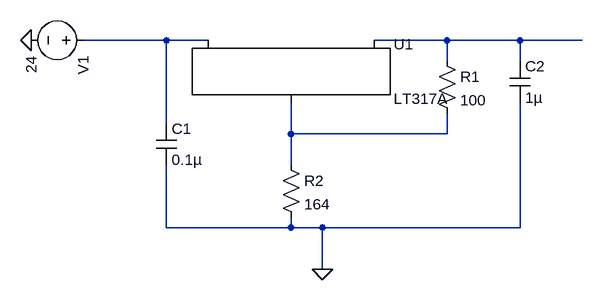
[diagram p0: schematic Draft1.asc]
Draft1.asc, the LTspice schematic file:
Version 4
SHEET 1 1972 680
WIRE -496 -96 -624 -96
WIRE -432 -96 -496 -96
WIRE -64 -96 -176 -96
WIRE 48 -96 -64 -96
WIRE 144 -96 48 -96
WIRE -64 -64 -64 -96
WIRE 48 -64 48 -96
WIRE -496 32 -496 -96
WIRE -304 48 -304 0
WIRE -64 48 -64 16
WIRE -64 48 -304 48
WIRE -304 96 -304 48
WIRE -496 192 -496 96
WIRE -304 192 -304 176
WIRE -304 192 -496 192
WIRE -256 192 -304 192
WIRE 48 192 48 0
WIRE 48 192 -256 192
WIRE -256 256 -256 192
FLAG -704 -96 0
FLAG -256 256 0
SYMBOL voltage -608 -96 R90
WINDOW 123 0 0 Left 0
WINDOW 39 0 0 Left 0
SYMATTR InstName V1
SYMATTR Value 24
SYMBOL PowerProducts\\LT317A -304 -96 R0
SYMATTR InstName U1
SYMBOL cap -512 32 R0
SYMATTR InstName C1
SYMATTR Value 0.1µ
SYMBOL cap 32 -64 R0
SYMATTR InstName C2
SYMATTR Value 1µ
SYMBOL res -80 -80 R0
SYMATTR InstName R1
SYMATTR Value 100
SYMBOL res -320 80 R0
SYMATTR InstName R2
SYMATTR Value 164

The netlist it stands for:
* Draft1.asc
V1 N001 0 24
XU1 N003 N002 N001 LT317A
C1 N001 0 0.1µ
C2 N002 0 1µ
R1 N002 N003 100
R2 N003 0 164
.lib LTC.lib
.backanno
.end